# Altium schematic sheet Main.SchDoc
size 152 x 152 mm; SheetNumber: 1; SheetTotal: 1
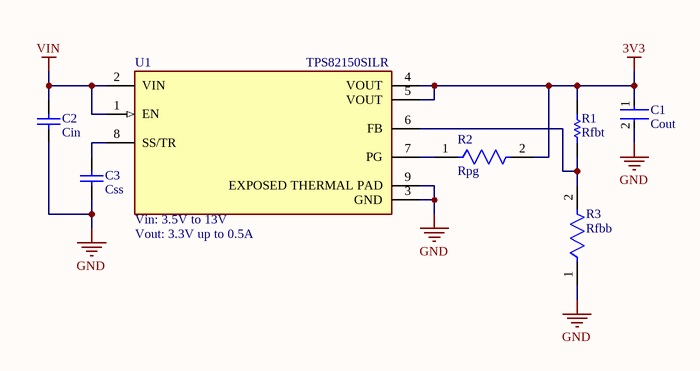
[diagram p0: Main.SchDoc]

## Parts
C1  Cout  [FP-GRM21B-0_15-MFG]
C2  Cin  [CAPC3216X180X55LL20T25]
C3  Css  [CAPC1005X55X25NL05T10]
R1  Rfbt  [RESC1005X40X25LL05T05]
R2  Rpg  [FP-CRCW0402-e3-IPC_C]
R3  Rfbb  [FP-CRCW0402-e3-IPC_C]
U1  TPS82150SILR  [FP-SIL0008D-MFG]

## Nets
3V3: C1.1 R1.2 R2.2 U1.4(VOUT) U1.5(VOUT)
GND: C1.2 C2.1 C3.1 R3.1 U1.3(GND) U1.9(EXPOSED_THERMAL_PAD)
VIN: C2.2 U1.1(EN) U1.2(VIN)
NetC3_2: C3.2 U1.8(SS/TR)
NetR1_1: R1.1 R3.2 U1.6(FB)
NetR2_1: R2.1 U1.7(PG)

## Notes on the sheet
- (near U1) Vin: 3.5V to 13V
- (near U1) Vout: 3.3V up to 0.5A

## Library data of the parts
C1 = CMP-2007-03385-2: Chip Multilayer Ceramic Capacitors for General Purpose, 0805, 22uF, X5R, 15%, 20%, 6.3V; Material: Ceramic; Max Operating Temperature: 85°C; Voltage: 6.3V; Min Operating Temperature: -55°C; Case/Package: 0805; Thickness: 0.053inch; Dielectric: X5R; Packaging: Tape and Reel; Depth: 1.25mm; Termination: SMD/SMT; Voltage Rating (DC): 6.3V; Radiation Hardening: No; Tolerance: 20%; Mount: Surface Mount; Lead Free: Lead Free; Package Quantity: 1; REACH SVHC: No SVHC; Voltage Rating: 6.3V; Capacitance: 22uF; Length: 2mm; Case Code (Imperial): 0805; Case Code (Metric): 2012; Width: 0.049inch; Height: 1.25mm
C2 = CMP-2000-06352-1: Chip Capacitor, 10 uF, +/- 10%, 16 V, -55 to 125 degC, 1206 (3216 Metric), RoHS, Tape and Reel; Manufacturer: Murata; Other Names: 490-3911-6; Product Training Modules: High-CapMultilayerCeramicCapacitors; Capacitance: 10µF; Temperature Coefficient: X7R; Catalog Drawings: GRMSeries_1206_1.6; Featured Product: GA3SafetyRecognizedCapsandHi-CapMLCC; Online Catalog: GRMSeries; Voltage - Rated: 16V; Size / Dimension: 0.126"Lx0.063"W(3.20mmx1.60mm); Applications: GeneralPurpose; Package Description: 2-Pin Surface Mount Device, Body 3.2 x 1.6 mm; Datasheet Version: 03/2016; Package Reference: 1206; Manufacturer URL: http://www.murata.com/; Standard Package: 1; Mounting Type: SurfaceMount,MLCC; Thickness (Max): 0.071"(1.80mm); Category: Capacitors; Family: CeramicCapacitors; Lead Spacing: -; Tolerance: ±10%; Packaging: Digi-Reel®; Lead Style: -; Package / Case: 1206(3216Metric); Datasheet URL: http://search.murata.co.jp/Ceramy/image/img/A01X/G101/ENG/GRM31CR71C106KAC7-01.pdf; Operating Temperature: -55°C~125°C; Mounting Technology: SurfaceMount; Series: GRM; Ratings: -; Height - Seated (Max): -; Features: -
C3 = CMP-2008-04082-1: Part Number: GRM1555C1E431JA01D; Manufacturer: Murata
R1 = CMP-2000-07451-1: 309k Ohm Chip Resistor, 0 Ohm, 0.1 W, -55 to 155 degC, 0402 (1005 Metric), RoHS, Tape and Reel; Manufacturer: Panasonic; Voltage Rating (DC): 50V; Temperature Coefficient: 600ppm/��C; Max Power Dissipation: 100mW; Resistance: 0mOhm; Tolerance: 5%; Number of Terminations: 2; Mount: SurfaceMount; Height: 0.35mm; Packaging: TapeandReel; Contact Plating: Tin; Manufacturer URL: http://www.panasonic.com/; Composition: ThickFilm; Max Operating Temperature: 155degC; REACH SVHC: NoSVHC; Case/Package: 0402; Package Reference: 402; Depth: 0.5mm; Package Description: 2-Pin Surface Mount Device, Body 1 x 0.5 mm; Datasheet URL: https://industrial.panasonic.com/cdbs/www-data/pdf/RDA0000/AOA0000C301.pdf; RoHSCompliant: True; Case Code (Imperial): 0402; Military Standard: Not; Min Operating Temperature: -55degC; Power Rating: 100mW; Datasheet Version: 03/2015; Length: 1mm; Case Code (Metric): 1005; Termination: SMD/SMT; Mounting Technology: SurfaceMount; Voltage Rating: 50V; Width: 0.02inch; Package Quantity: 1; Lead Free: LeadFree; Radiation Hardening: No
R2 R3 = CMP-2002-08123-3: RES Thick Film, 100kΩ, 1%, 0.063W, 100ppm/°C, 0402; Power Rating: 63mW; Resistance: 100kR; Voltage Rating (DC): 50V; Lead Free: Lead Free; Height: 0.35mm; Contact Plating: Tin; Min Operating Temperature: -55°C; Package Quantity: 10000; Case/Package: 0402; Temperature Coefficient: 100ppm/°C; Number of Terminations: 2; Packaging: Tape and Reel; Max Power Dissipation: 63mW; Case Code (Metric): 1005; Mount: Surface Mount; Width: 0.02inch; Termination: SMD/SMT; Length: 1mm; Number of Pins: 2; Weight: 2.3E-05oz; Radiation Hardening: No; Tolerance: 1%; Military Standard: Not; Features: Automotive AEC-Q200; Depth: 0.5mm; Composition: Thick Film; Max Operating Temperature: 155°C; Voltage Rating: 50V; Case Code (Imperial): 0402
U1 = CMP-04918-000050-1: DC DC CONVERTER 0.9-6V; Manufacturer: Texas Instruments; Max Junction Temp: +110°C; Description: Non-Isolated PoL Module DC DC Converter 1 Output 0.9 ~ 6V    1A 3V - 17V Input; Number Of Outputs: 1; Max Supply Voltage: 17V; Max Duty Cycle: 100%; Output Type: AdjustableProgrammable; Switching Frequency: 2MHz; Output Current: 1A; Switching Topology: Buck; Min Supply Voltage: 3V; Nominal Supply Current: 20uA; RoHS: TRUE; Category: IC; Output Voltage: 0.9-6V; Temperature Range Low: -40°C; Device Class L1: Integrated Circuits (ICs); Automotive: No; ComponentLink2URL: http://www.ti.com/lit/ds/symlink/tps82150.pdf; Package: SIL0008D; Manufacturer Part Number: TPS82150SILR; Temperature: -40°C to +125°C; Device Class L2: Power Management ICs; Lead Free: Yes; ComponentLink2Description: Datasheet; Device Class L3: Voltage Regulators - Switching; Octopart: https://octopart.com/tps82150silr-texas+instruments-83003514; Temperature Range High: +125°C; Height: 1.53mm; Digikey Description: DC DC CONVERTER 0.9-6V